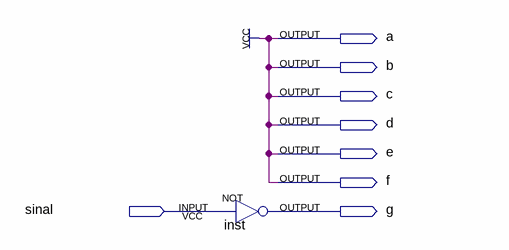
[diagram p0: schematic sheet]
// Quartus schematic Sign.bdf as structural Verilog: 1 symbols, 8 pins
module Sign (
  input  sinal,
  output a,
  output b,
  output c,
  output d,
  output e,
  output f,
  output g
);

  not inst (g, sinal);

  assign a = 1'b1;
  assign b = 1'b1;
  assign c = 1'b1;
  assign d = 1'b1;
  assign e = 1'b1;
  assign f = 1'b1;
endmodule
